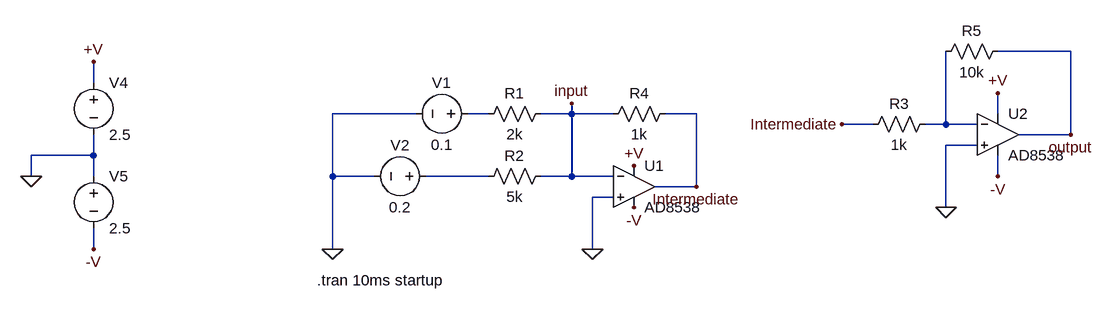
[diagram p0: schematic FullCircuit.asc]
FullCircuit.asc, the LTspice schematic file:
Version 4
SHEET 1 952 680
WIRE 896 -96 784 -96
WIRE -608 -48 -608 -80
WIRE -112 0 -240 0
WIRE 0 0 -32 0
WIRE 128 0 128 -16
WIRE 128 0 80 0
WIRE 192 0 128 0
WIRE 320 0 272 0
WIRE 784 0 784 -32
WIRE 592 16 544 16
WIRE 704 16 704 -96
WIRE 704 16 672 16
WIRE 752 16 704 16
WIRE 896 32 896 -96
WIRE 896 32 816 32
WIRE 752 48 704 48
WIRE -608 64 -608 32
WIRE -608 64 -704 64
WIRE -704 96 -704 64
WIRE -608 96 -608 64
WIRE -240 96 -240 0
WIRE -176 96 -240 96
WIRE 0 96 -96 96
WIRE 128 96 128 0
WIRE 128 96 80 96
WIRE 192 96 128 96
WIRE 784 96 784 64
WIRE 320 112 320 0
WIRE 320 112 256 112
WIRE 192 128 160 128
WIRE 704 144 704 48
WIRE -608 208 -608 176
WIRE -240 208 -240 96
WIRE 160 208 160 128
FLAG 160 208 0
FLAG -240 208 0
FLAG 320 112 Intermediate
FLAG 128 -16 input
FLAG 224 80 +V
FLAG 224 144 -V
FLAG -704 96 0
FLAG -608 -80 +V
FLAG -608 208 -V
FLAG 784 -32 +V
FLAG 784 96 -V
FLAG 544 16 Intermediate
FLAG 896 32 output
FLAG 704 144 0
SYMBOL res 96 -16 R90
WINDOW 0 0 56 VBottom 2
WINDOW 3 32 56 VTop 2
SYMATTR InstName R1
SYMATTR Value 2k
SYMATTR SpiceLine tol=1
SYMBOL res 96 80 R90
WINDOW 0 0 56 VBottom 2
WINDOW 3 32 56 VTop 2
SYMATTR InstName R2
SYMATTR Value 5k
SYMATTR SpiceLine tol=1
SYMBOL voltage -16 0 R90
WINDOW 0 -32 56 VBottom 2
WINDOW 3 32 56 VTop 2
WINDOW 123 0 0 Left 0
WINDOW 39 0 0 Left 0
SYMATTR InstName V1
SYMATTR Value 0.1
SYMBOL voltage -80 96 R90
WINDOW 0 -32 56 VBottom 2
WINDOW 3 32 56 VTop 2
WINDOW 123 0 0 Left 0
WINDOW 39 0 0 Left 0
SYMATTR InstName V2
SYMATTR Value 0.2
SYMBOL res 288 -16 R90
WINDOW 0 0 56 VBottom 2
WINDOW 3 32 56 VTop 2
SYMATTR InstName R4
SYMATTR Value 1k
SYMATTR SpiceLine tol=1
SYMBOL voltage -608 -64 R0
WINDOW 123 0 0 Left 0
WINDOW 39 0 0 Left 0
SYMATTR InstName V4
SYMATTR Value 2.5
SYMBOL voltage -608 80 R0
WINDOW 123 0 0 Left 0
WINDOW 39 0 0 Left 0
SYMATTR InstName V5
SYMATTR Value 2.5
SYMBOL OpAmps\\AD8538 224 48 R0
SYMATTR InstName U1
SYMBOL OpAmps\\AD8538 784 -32 R0
SYMATTR InstName U2
SYMBOL res 688 0 R90
WINDOW 0 0 56 VBottom 2
WINDOW 3 32 56 VTop 2
SYMATTR InstName R3
SYMATTR Value 1k
SYMATTR SpiceLine tol=1
SYMBOL res 800 -112 R90
WINDOW 0 0 56 VBottom 2
WINDOW 3 32 56 VTop 2
SYMATTR InstName R5
SYMATTR Value 10k
SYMATTR SpiceLine tol=1
TEXT -264 256 Left 2 !.tran 10ms startup

The netlist it stands for:
* FullCircuit.asc
R1 input N001 2k tol=1
R2 input N003 5k tol=1
V1 N001 0 0.1
V2 N003 0 0.2
R4 Intermediate input 1k tol=1
V4 +V 0 2.5
V5 0 -V 2.5
XU1 0 input +V -V Intermediate AD8538  ; pins In+ In- V+ V- OUT
XU2 0 N002 +V -V output AD8538  ; pins In+ In- V+ V- OUT
R3 N002 Intermediate 1k tol=1
R5 output N002 10k tol=1
.tran 10ms startup
.backanno
.end

* Results of the author's LTspice run, read from the files saved beside the schematic
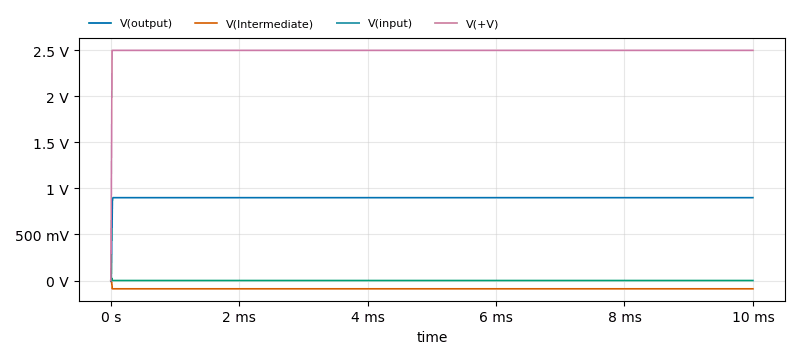
[diagram p1: Transient Analysis of FullCircuit.asc, plotted from the saved traces]
* Transient Analysis, 1 run:
*   V(output): min -9.835 mV, max 899.9 mV, average 898.4 mV, rms 899 mV, last 899.9 mV
*   V(Intermediate): min -89.98 mV, max 7.912 mV, average -89.83 mV, rms 89.89 mV, last -89.98 mV
*   V(input): min -87.21 µV, max 25.15 mV, average 47.9 µV, rms 806.5 µV, last 14.14 µV
*   V(+V): min 0 V, max 2.5 V, average 2.497 V, rms 2.498 V, last 2.5 V